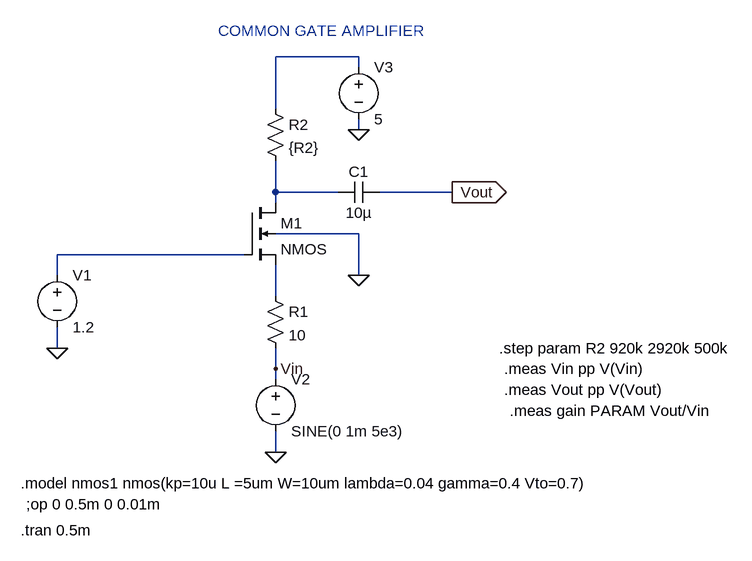
[diagram p0: schematic COMMON GATE AMPLIFIER.asc]
COMMON GATE AMPLIFIER.asc, the LTspice schematic file:
Version 4
SHEET 1 972 680
WIRE 368 -96 240 -96
WIRE 368 -80 368 -96
WIRE 240 -16 240 -96
WIRE 368 16 368 0
WIRE 240 112 240 64
WIRE 336 112 240 112
WIRE 512 112 400 112
WIRE 240 128 240 112
WIRE 368 176 240 176
WIRE 192 208 -96 208
WIRE -96 240 -96 208
WIRE 368 240 368 176
WIRE 240 272 240 224
WIRE -96 352 -96 320
WIRE 240 384 240 352
WIRE 240 400 240 384
WIRE 240 512 240 480
FLAG 240 512 0
FLAG -96 352 0
FLAG 368 240 0
FLAG 368 16 0
FLAG 512 112 Vout
IOPIN 512 112 Out
FLAG 240 384 Vin
SYMBOL nmos4 192 128 R0
SYMATTR InstName M1
SYMBOL voltage -96 224 R0
WINDOW 123 0 0 Left 0
WINDOW 39 0 0 Left 0
SYMATTR InstName V1
SYMATTR Value 1.2
SYMBOL voltage 240 384 R0
WINDOW 123 0 0 Left 0
WINDOW 39 0 0 Left 0
SYMATTR InstName V2
SYMATTR Value SINE(0 1m 5e3)
SYMBOL res 224 256 R0
SYMATTR InstName R1
SYMATTR Value 10
SYMBOL voltage 368 -96 R0
WINDOW 123 0 0 Left 0
WINDOW 39 0 0 Left 0
SYMATTR InstName V3
SYMATTR Value 5
SYMBOL res 224 -32 R0
SYMATTR InstName R2
SYMATTR Value {R2}
SYMBOL cap 400 96 R90
WINDOW 0 0 32 VBottom 2
WINDOW 3 32 32 VTop 2
SYMATTR InstName C1
SYMATTR Value 10µ
TEXT -152 560 Left 2 !.model nmos1 nmos(kp=10u L =5um W=10um lambda=0.04 gamma=0.4 Vto=0.7)
TEXT -144 592 Left 2 !;op 0 0.5m 0 0.01m
TEXT -152 632 Left 2 !.tran 0.5m
TEXT 152 -136 Left 2 ;COMMON GATE AMPLIFIER
TEXT 584 352 Left 2 !.step param R2 920k 2920k 500k
TEXT 592 384 Left 2 !.meas Vin pp V(Vin)
TEXT 592 416 Left 2 !.meas Vout pp V(Vout)
TEXT 600 448 Left 2 !.meas gain PARAM Vout/Vin

The netlist it stands for:
* COMMON GATE AMPLIFIER.asc
M1 N002 N003 N004 0 NMOS
V1 N003 0 1.2
V2 Vin 0 SINE(0 1m 5e3)
R1 N004 Vin 10
V3 N001 0 5
R2 N001 N002 {R2}
C1 Vout N002 10µ
.model NMOS NMOS
.model PMOS PMOS
.lib standard.mos
.model nmos1 nmos(kp=10u L =5um W=10um lambda=0.04 gamma=0.4 Vto=0.7)
;op 0 0.5m 0 0.01m
.tran 0.5m
* COMMON GATE AMPLIFIER
.step param R2 920k 2920k 500k
.meas Vin pp V(Vin)
.meas Vout pp V(Vout)
.meas gain PARAM Vout/Vin
.backanno
.end